# Altium schematic sheet PIRA BLE, LORA, RTC.SchDoc
size A3; SheetNumber: 3
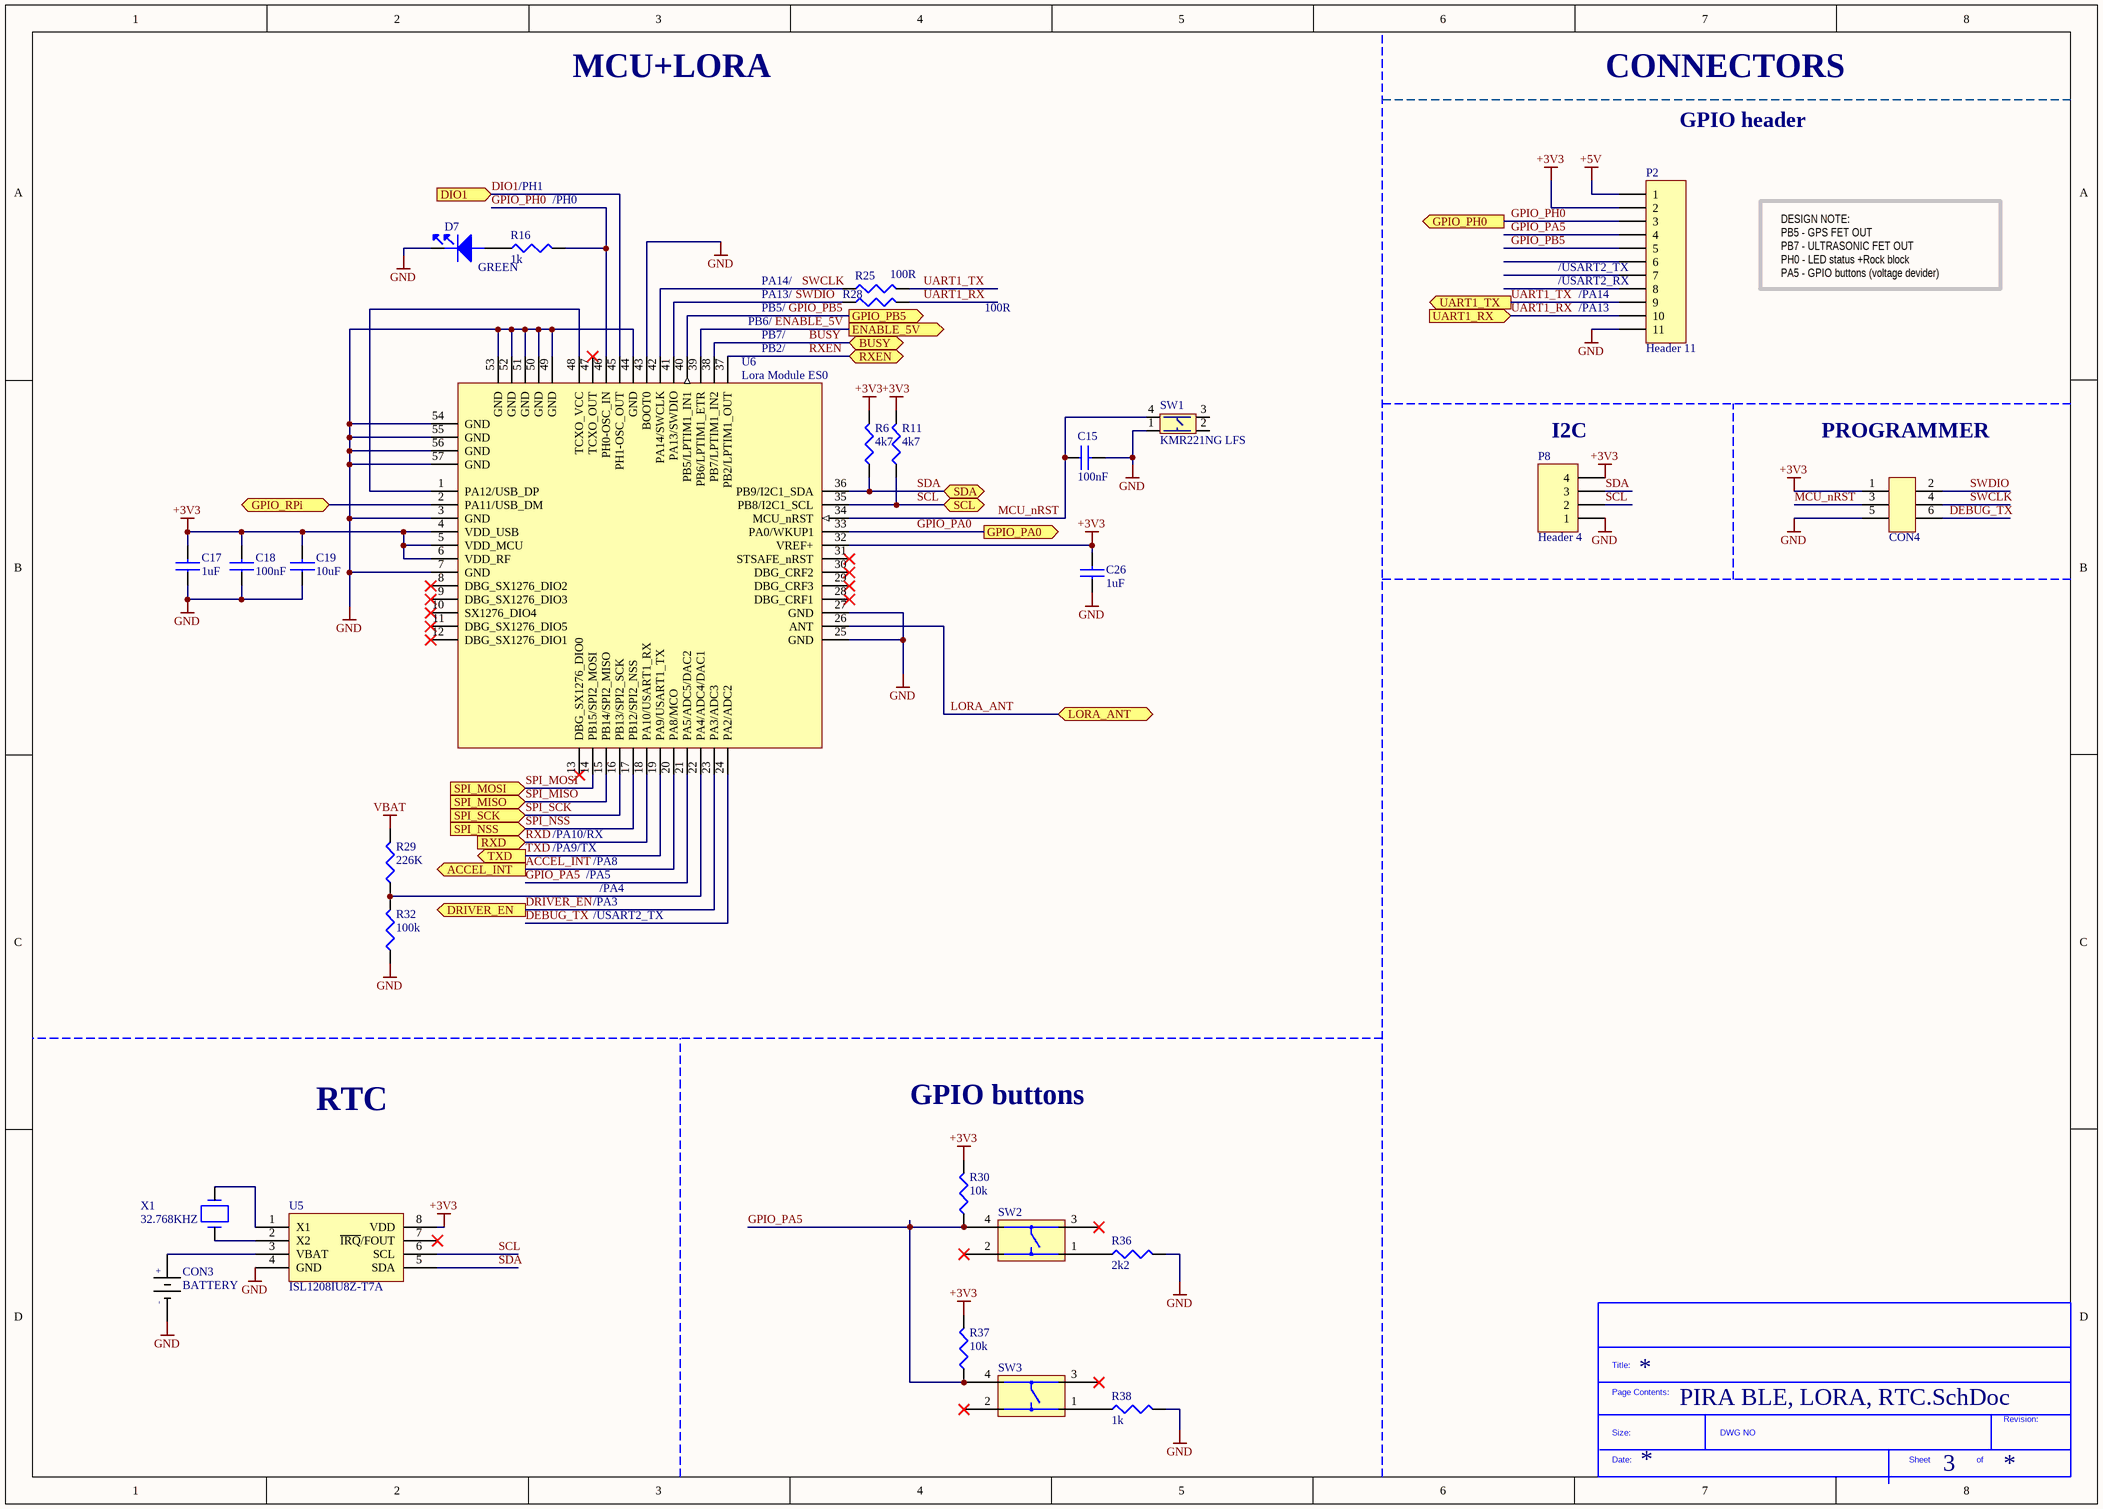
[diagram p0: PIRA BLE, LORA, RTC.SchDoc]

## Parts
*?  SDTitleBlock  (value not drawn)  (graphical)
C15  100nF  [CAP0603]
C17  1uF  [CAP0603]
C18  100nF  [CAP0603]
C19  10uF  [CAP0603]
C26  1uF  [CAP0603]
CON3  BATTERY  [CR-2032/VCN]
CON4  Tag connect  [TC2030-IDC-NL]  (value not drawn)  (no BOM)
D7  LED GREEN  [LED0603]  (value not drawn)
P2  Header 11  [HDR1X11]
P8  Header 4  [HDR1X4]
R6  4k7  [RES0603]
R11  4k7  [RES0603]
R16  1k  [RES0603]
R25  100R  [RES0603]
R28  100R  [RES0603]
R29  226K  [RES0603]
R30  10k  [RES0603]
R32  100k  [RES0603]
R36  2k2  [RES0603]
R37  10k  [RES0603]
R38  1k  [RES0603]
SW1  KMR221NG LFS  [Tactile button]
SW2  BTN - B3F-1070  [BTN B3F-1070]  (value not drawn)
SW3  BTN - B3F-1070  [BTN B3F-1070]  (value not drawn)
U5  ISL1208IU8Z-T7A  [TSOP65P500X110-8N]
U6  Lora Module ES0  [Lora Module ES0]
X1  32.768KHZ  [LFXTAL009678]

## Ports
ACCEL_INT (out), BUSY (bidir), DIO1 (in), DRIVER_EN (out), ENABLE_5V (out), GPIO_PA0 (out), GPIO_PB5 (out), GPIO_PH0 (out), GPIO_RPi (bidir), LORA_ANT (bidir), RXD (in), RXEN (bidir), SCL (bidir), SDA (bidir), SPI_MISO (in), SPI_MOSI (in), SPI_NSS (in), SPI_SCK (in), TXD (out), UART1_RX (in), UART1_TX (out)

## Nets
+3V3: C17.2 C18.2 C19.2 C26.2 CON4.1 P2.2 P8.4 R6.2 R11.2 R30.2 R37.2 U5.8(VDD) U6.4(VDD_USB) U6.5(VDD_MCU) U6.6(VDD_RF) U6.32(VREF+)
+5V: P2.1
GND: C15.2 C17.1 C18.1 C19.1 C26.1 CON3.NEG CON4.5 D7.1(cathode) P2.11 P8.1 R32.1 R36.2 R38.2 SW1.1 U5.4(GND) U6.3(GND) U6.7(GND) U6.25(GND) U6.27(GND) U6.43(BOOT0) U6.44(GND) U6.49(GND) U6.50(GND) U6.51(GND) U6.52(GND) U6.53(GND) U6.54(GND) U6.55(GND) U6.56(GND) U6.57(GND)
VBAT: R29.2
ACCEL_INT: U6.20(PA8/MCO) ; port ACCEL_INT
BUSY: U6.38(PB7/LPTIM1_IN2) ; port BUSY
DEBUG_TX: CON4.6 U6.24(PA2/ADC2)
DIO1: U6.45(PH1-OSC_OUT) ; port DIO1
DRIVER_EN: U6.23(PA3/ADC3) ; port DRIVER_EN
ENABLE_5V: U6.39(PB6/LPTIM1_ETR) ; port ENABLE_5V
GPIO_PA0: U6.33(PA0/WKUP1) ; port GPIO_PA0
GPIO_PA5: P2.4 R30.1 R37.1 SW2.4 SW3.4 U6.21(PA5/ADC5/DAC2)
GPIO_PB5: P2.5 U6.40(PB5/LPTIM1_IN1) ; port GPIO_PB5
GPIO_PH0: P2.3 R16.2 U6.46(PH0-OSC_IN) ; port GPIO_PH0
GPIO_RPi: U6.2(PA11/USB_DM) ; port GPIO_RPi
LORA_ANT: U6.26(ANT) ; port LORA_ANT
MCU_nRST: C15.1 CON4.3 SW1.4 U6.34(MCU_nRST)
RXD: U6.18(PA10/USART1_RX) ; port RXD
RXEN: U6.37(PB2/LPTIM1_OUT) ; port RXEN
SCL: P8.2 R11.1 U5.6(SCL) U6.35(PB8/I2C1_SCL) ; port SCL
SDA: P8.3 R6.1 U5.5(SDA) U6.36(PB9/I2C1_SDA) ; port SDA
SPI_MISO: U6.15(PB14/SPI2_MISO) ; port SPI_MISO
SPI_MOSI: U6.14(PB15/SPI2_MOSI) ; port SPI_MOSI
SPI_NSS: U6.17(PB12/SPI2_NSS) ; port SPI_NSS
SPI_SCK: U6.16(PB13/SPI2_SCK) ; port SPI_SCK
SWCLK: CON4.4 R25.1 U6.42(PA14/SWCLK)
SWDIO: CON4.2 R28.1 U6.41(PA13/SWDIO)
TXD: U6.19(PA9/USART1_TX) ; port TXD
UART1_RX: P2.10 R28.2 ; port UART1_RX
UART1_TX: P2.9 R25.2 ; port UART1_TX
NetCON3_POS: CON3.POS U5.3(VBAT)
NetD7_2: D7.2(ANODE) R16.1
NetR29_1: R29.1 R32.2 U6.22(PA4/ADC4/DAC1)
NetR36_1: R36.1 SW2.1
NetR38_1: R38.1 SW3.1
NetU5_1: U5.1(X1) X1.2
NetU5_2: U5.2(X2) X1.1
NetU6_1: U6.1(PA12/USB_DP) U6.48(TCXO_VCC)

Not connected (* = marked no-connect by the designer): P2 6 7 8; SW1 2 3; SW2 2* 3*; SW3 2* 3*; U5 7(~{IRQ}/FOUT)*; U6 8(DBG_SX1276_DIO2)* 9(DBG_SX1276_DIO3)* 10(SX1276_DIO4)* 11(DBG_SX1276_DIO5)* 12(DBG_SX1276_DIO1)* 13(DBG_SX1276_DIO0)* 28(DBG_CRF1)* 29(DBG_CRF3)* 30(DBG_CRF2)* 31(STSAFE_nRST)* 47(TCXO_OUT)*

## Notes on the sheet
- MCU+LORA
- CONNECTORS
- GPIO header
- /PH1
- (near R16) /PH0
- PB5/
- PA13/
- PA14/
- (near P2) /USART2_TX
- (near P2) /USART2_RX
- (near P2) /PA13
- (near P2) /PA14
- DESIGN NOTE:
  PB5 - GPS FET OUT
  PB7 - ULTRASONIC FET OUT
  PH0 - LED status +Rock block
  PA5 - GPIO buttons (voltage devider)
- PB6/
- (near U6) PB7/
- (near U6) PB2/
- (near P8) I2C
- (near CON4) PROGRAMMER
- /PA9/TX
- /PA10/RX
- /PA5
- /PA8
- /PA3
- /USART2_TX
- /PA4
- RTC
- GPIO buttons
- (in symbol CR-2032/VCN) +; -
- (in symbol LED - LED GREEN) GREEN
- (in symbol SDTitleBlock) Title:; Page Contents:; Revision:; Size:; DWG NO; Date:; Sheet; of

## Library data of the parts
C15 C18 = 100nF: MURATA - GRM188R71C104KA01J - CAP, MLCC, X7R, 0.1UF, 16V, 0603; Ceramic Capacitor Case: 0603 [1608 Metric]; Capacitance: 0.1; Voltage Rating: 16; Capacitance Tolerance: ± 10%; Dielectric Characteristic: X7; Product Range: GRM Series; SVHC: No SVHC (20-Jun-2016; Supplier 1: Farnell; Manufacturer: MURATA; Manufacturer Part Number: GRM188R71C104KA01J; RoHS: YES; Stock 1: 18297; Pricing 1: 10=0.0145, 100=0.0126, 500=0.0081, 2500=0.0059, 5000=0.0052, 10000=0.0046, 50000=0.0036, 100000=0.0035 (GBP); Packaging: Cut Tape; Operating Temperature Min: -55; Operating Temperature Max: 125; Automotive Qualification Standard: -; MSL: MSL 1 - Unlimited; ComponentLink1URL: http://www.farnell.com/datasheets/2189124.pdf; ComponentLink1Description: http://www.farnell.com/datasheets/2189124.pdf; Supplier Part Number 1: 2688519
C17 = 1uF: MURATA - GRM188R61H105KAALD - CAP, MLCC, X5R, 1UF, 50V, 0603; Ceramic Capacitor Case: 0603 [1608 Metric]; Capacitance: 1; Voltage Rating: 50; Capacitance Tolerance: ± 10%; Dielectric Characteristic: X5; Product Range: GRM Series; SVHC: No SVHC (17-Dec-2015); Capacitor Terminals: SMD<!--FANDB--><div class="features-and-benefits-container"><div class="features-and-benefits-description"><span class="features-benefits-value">The Murata GRM series capacitors are Multilayer Ceramic Chip Capacitors (MLCC) used for general purpose applications. These MLCC capacitors are classified into temperature compensating and high dielectric constant types depending on the change in electrostatic capacitance due to change in temperature. The temperature compensating capacitors feature a small rate of change in electrostatic capacitance as the temperature changes and are used for applications such as filters and high frequency circuit matching. The high dielectric constant capacitors use materials with a high dielectric constant and feature a large electrostatic capacitance. Typical applications are power supply decoupling and smoothing circuits.</span></div><div class="features-and-benefits-list"><ul class="features-and-benefits-list-list"><li class="features-and-benefits-list-item">Large capacity and small size in a multilayer structure</li><li class="features-and-benefits-list-item">Capacitance value ranging from 0.1pF to 220?F</li><li class="features-and-benefits-list-item">Tin plated external electrodes, excellent solderability</li><li class="features-and-benefits-list-item">Provides good high frequency characteristics</li><li class="features-and-benefits-list-item">Excellent pulse response</li><li class="features-and-benefits-list-item">High reliability</li><li class="features-and-benefits-list-item">Capacitor size varies from 0.4×0.2mm to 5.7×5.0mm</li><li class="features-and-benefits-list-item">Rated voltage of 2.5VDC to 3.15; Supplier 1: Farnell; Manufacturer: MURATA; Manufacturer Part Number: GRM188R61H105KAALD; RoHS: YES; Stock 1: 62682; Pricing 1: 10=0.093, 100=0.062, 500=0.0507, 1000=0.0465, 2000=0.0429, 4000=0.0399, 20000=0.0372, 40000=0.0365 (GBP); Packaging: Cut Tape; Operating Temperature Min: -55; Operating Temperature Max: 85; Automotive Qualification Standard: -; MSL: -; Capacitance Tolerance ±: ± 10%; ComponentLink1URL: http://www.farnell.com/datasheets/2048611.pdf; ComponentLink1Description: http://www.farnell.com/datasheets/2048611.pdf; Supplier Part Number 1: 1845736
C19 = 10uF: 10uf/0603/20%; Manufacturer: KEMET; Manufacturer Part Number: C0603C106M8PACTU; Supplier 1: Farnell; Stock 1: 0; Pricing 1: 10=0.555, 100=0.315, 500=0.238, 1000=0.2, 2000=0.174, 4000=0.143, 20000=0.123 (GBP); Supplier Part Number 1: 2820985
C26 = C - 1uF: MURATA - GRM188R61H105KAALD - CAP, MLCC, X5R, 1UF, 50V, 0603; IRNAS Part No.: I-200006; Ceramic Capacitor Case: 0603 [1608 Metric]; Capacitance: 1; Voltage Rating: 50; Capacitance Tolerance: ± 10%; Dielectric Characteristic: X5; Product Range: GRM Series; SVHC: No SVHC (17-Dec-2015); Capacitor Terminals: SMD<!--FANDB--><div class="features-and-benefits-container"><div class="features-and-benefits-description"><span class="features-benefits-value">The Murata GRM series capacitors are Multilayer Ceramic Chip Capacitors (MLCC) used for general purpose applications. These MLCC capacitors are classified into temperature compensating and high dielectric constant types depending on the change in electrostatic capacitance due to change in temperature. The temperature compensating capacitors feature a small rate of change in electrostatic capacitance as the temperature changes and are used for applications such as filters and high frequency circuit matching. The high dielectric constant capacitors use materials with a high dielectric constant and feature a large electrostatic capacitance. Typical applications are power supply decoupling and smoothing circuits.</span></div><div class="features-and-benefits-list"><ul class="features-and-benefits-list-list"><li class="features-and-benefits-list-item">Large capacity and small size in a multilayer structure</li><li class="features-and-benefits-list-item">Capacitance value ranging from 0.1pF to 220?F</li><li class="features-and-benefits-list-item">Tin plated external electrodes, excellent solderability</li><li class="features-and-benefits-list-item">Provides good high frequency characteristics</li><li class="features-and-benefits-list-item">Excellent pulse response</li><li class="features-and-benefits-list-item">High reliability</li><li class="features-and-benefits-list-item">Capacitor size varies from 0.4×0.2mm to 5.7×5.0mm</li><li class="features-and-benefits-list-item">Rated voltage of 2.5VDC to 3.15; Supplier 1: Farnell; Manufacturer: MURATA; Manufacturer Part Number: GRM188R61H105KAALD; RoHS: YES; Stock 1: 62682; Pricing 1: 10=0.093, 100=0.062, 500=0.0507, 1000=0.0465, 2000=0.0429, 4000=0.0399, 20000=0.0372, 40000=0.0365 (GBP); Packaging: Cut Tape; Operating Temperature Min: -55; Operating Temperature Max: 85; Automotive Qualification Standard: -; MSL: -; Capacitance Tolerance ±: ± 10%; ComponentLink1URL: http://www.farnell.com/datasheets/2048611.pdf; ComponentLink1Description: http://www.farnell.com/datasheets/2048611.pdf; Supplier Part Number 1: 1845736
CON3 = CR-2032/VCN: BATT LITH COIN 3V CELL PC PINS; Manufacturer: Panasonic BSG; Brand: Panasonic Battery; Battery Size: 2032; Capacity: 225 mAh; Chemistry: Lithium; Rechargeable/Non-Rechargeable: Non-Rechargeable; Supplier 1: Farnell; Manufacturer Part Number: CR-2032/VCN; Stock 1: 1004; Pricing 1: 1=0.91, 50=0.892, 100=0.874, 500=0.855, 1000=0.837 (GBP); Product Category: Coin Cell Battery; RoHS: Not Applicable; Series: CR; Output Voltage: 3 V; Termination Style: Through Hole; Orientation: Vertical; Diameter: 20 mm; Height: 3.2 mm; Operating Temperature Range: - 30 C to + 60 C; Packaging: Bulk; Factory Pack Quantity: 480; Type: Lithium Primary Coil Batteries; Part # Aliases: CR-2032/VCN; ComponentLink1URL: http://www.mouser.com/ds/2/315/AAA4000CE51-586417.pdf; ComponentLink1Description: http://www.mouser.com/ds/2/315/AAA4000CE51-586417.pdf; ComponentLink2URL: http://uk.rs-online.com/webdocs/108e/0900766b8108ebf4.pdf; ComponentLink2Description: http://uk.rs-online.com/webdocs/108e/0900766b8108ebf4.pdf; ComponentLink3URL: https://na.industrial.panasonic.com/sites/default/pidsa/files/panasonic-lithium-cr2032-datasheet.pdf; ComponentLink3Description: https://na.industrial.panasonic.com/sites/default/pidsa/files/panasonic-lithium-cr2032-datasheet.pdf; Supplier Part Number 1: 1892670
CON4 = tag connecot 6 pin
D7 = LED - LED GREEN: HSME-C191 -  LED, Green, SMD, 0603, 20 mA, 2.1 V, 572 nm; Manufacturer: BROADCOM LIMITED; Manufacturer Part Number: HSMS-C190; LED Colour: Red; Forward Current If: 20; Forward Voltage: 2.1; Wavelength Typ: 626; Luminous Intensity: 10; Viewing Angle: 170°; Lens Shape: Rectangular; SVHC: No SVHC (17-Dec-2015)<!--FANDB--><div class="features-and-benefits-container"><div class="features-and-benefits-description"><span class="features-benefits-value">The HSMS-C190 is a HER SMD Chip LED with untinted/diffused lens, made of GaP. It is designed in an industry standard package 1.6 x 0.8mm footprint with 0.8mm profile. It is compatible with IR reflow solder processes. The small size and wide viewing angle make this LED prime choices for backlighting applications and front panel illumination especially where space is a premium.</span></div><div class="features-and-benefits-list"><ul class="features-and-benefits-list-list"><li class="features-and-benefits-list-item">Small size</li><li class="features-and-benefits-list-item">Industry standard footprint</li><li class="features-and-benefits-list-item">Compatible with IR solder</li><li class="features-and-benefits-list-item">Diffused optics</li><li class="features-and-benefits-list-item">-40 to 85; RoHS: YES; Stock 1: 7534; Pricing 1: 1=0.361, 10=0.256, 50=0.235, 100=0.106, 200=0.101 (GBP); LED Mounting: SMD; Bulb Size: -; Packaging: Cut Tape; Product Range: -; Automotive Qualification Standard: -; MSL: -; ComponentLink3URL: http://www.farnell.com/datasheets/2095939.pdf?_ga=2.85835929.1644194861.1561957338-1373726713.1554121096; ComponentLink3Description: Datasheet; Supplier 1: Farnell; Supplier Part Number 1: 1219743
P2 = Header 11: Header, 11-Pin; LatestRevisionDate: 17-Jul-2002; LatestRevisionNote: Re-released for DXP Platform.; Publisher: Altium Limited; Supplier Part Number 1: Header 2.54mm
P8 = Header 4: Header, 4-Pin; LatestRevisionDate: 17-Jul-2002; LatestRevisionNote: Re-released for DXP Platform.; Publisher: Altium Limited; Supplier Part Number 1: Header 2.54mm
R6 R11 = R - 4k7: MULTICOMP - MCMR06X4701FTL - RES, CERAMIC, 4K7, 1%, 0.1W, 0603; IRNAS Part No.: I-100003; Resistance: 4.7; Voltage Rating: 75; Resistor Case Style: 0603 [1608 Metric]; Power Rating: 100; Product Range: MCMR Series; Temperature Coefficient: ± 100; SVHC: No SVHC (12-Jan-2017)<!--FANDB--><div class="features-and-benefits-container"><div class="features-and-benefits-description"><span class="features-benefits-value">The Multicomp MCMR series resistors are automotive grade, anti sulphured thick film chip resistor. The resistance range includes E24 and E96 decade values from 1ohm to 10Mohm. These resistors are constructed on top of a high grade ceramic body.</span></div><div class="features-and-benefits-list"><ul class="features-and-benefits-list-list"><li class="features-and-benefits-list-item">EIA 0402, 0603, 0805, 1206 chip sizes available</li><li class="features-and-benefits-list-item">High reliability and stability</li><li class="features-and-benefits-list-item">Automotive grade AEC-Q200 compliant</li><li class="features-and-benefits-list-item">Complaint with (IEC 60068-1) 55/155/56 climatic category</li><li class="features-and-benefits-list-item">Maximum operation voltage of 50V, 75V, 150V and 200V</li><li class="features-and-benefits-list-item">Power rating of 62.5mW, 100mW, 125mW and 250mW</li><li class="features-and-benefits-list-item">Available in ±1% and ±5% tolerance</li><li class="features-and-benefits-list-item">Temperature coefficient (TCR) of +200ppm/°C, +100ppm/°C and -200ppm/°C to +400ppm/°C</li><li class="features-and-benefits-list-item">Operating temperature range -55°C to 155; Supplier 1: Farnell; Manufacturer: MULTICOMP; Manufacturer Part Number: MCMR06X4701FTL; RoHS: Y-EX; Stock 1: 218618; Pricing 1: 10=0.0085, 100=0.0051, 500=0.0036, 1000=0.0028, 2500=0.0023 (GBP); Resistance Tolerance: ± 1%; Packaging: Cut Tape; Resistor Element Material: Ceramic; Automotive Qualification Standard: -; ComponentLink1URL: http://www.farnell.com/datasheets/1716707.pdf; ComponentLink1Description: http://www.farnell.com/datasheets/1716707.pdf; Supplier Part Number 1: 2073509
R16 R38 = R - 1k: MULTICOMP - MCMR06X102 JTL - RES, CERAMIC, 1K, 5%, 0.1W, 0603; IRNAS Part No.: I-100042; Resistance: 1; Voltage Rating: 75; Resistor Case Style: 0603 [1608 Metric]; Power Rating: 100; Product Range: MCMR Series; Temperature Coefficient: ± 100; Resistor Mounting: Surface Mount Device<!--FANDB--><div class="features-and-benefits-container"><div class="features-and-benefits-description"><span class="features-benefits-value">The Multicomp MCMR series resistors are automotive grade, anti sulphured thick film chip resistor. The resistance range includes E24 and E96 decade values from 1ohm to 10Mohm. These resistors are constructed on top of a high grade ceramic body.</span></div><div class="features-and-benefits-list"><ul class="features-and-benefits-list-list"><li class="features-and-benefits-list-item">EIA 0402, 0603, 0805, 1206 chip sizes available</li><li class="features-and-benefits-list-item">High reliability and stability</li><li class="features-and-benefits-list-item">Automotive grade AEC-Q200 compliant</li><li class="features-and-benefits-list-item">Complaint with (IEC 60068-1) 55/155/56 climatic category</li><li class="features-and-benefits-list-item">Maximum operation voltage of 50V, 75V, 150V and 200V</li><li class="features-and-benefits-list-item">Power rating of 62.5mW, 100mW, 125mW and 250mW</li><li class="features-and-benefits-list-item">Available in ±1% and ±5% tolerance</li><li class="features-and-benefits-list-item">Temperature coefficient (TCR) of +200ppm/°C, +100ppm/°C and -200ppm/°C to +400ppm/°C</li><li class="features-and-benefits-list-item">Operating temperature range -55°C to 155; Supplier 1: Farnell; Manufacturer: MULTICOMP; Manufacturer Part Number: MCMR06X102 JTL; RoHS: Y-EX; Stock 1: 18133; Pricing 1: 10=0.0089, 100=0.0076, 500=0.0063, 1000=0.0049, 2500=0.0033, 5000=0.0024, 25000=0.0016, 50000=0.0013 (GBP); Resistance Tolerance: ± 5%; Packaging: Cut Tape; Resistor Element Material: Ceramic; Automotive Qualification Standard: -; ComponentLink1URL: http://www.farnell.com/datasheets/1716707.pdf; ComponentLink1Description: http://www.farnell.com/datasheets/1716707.pdf; Supplier Part Number 1: 2073354
R25 R28 = R - 100R: MULTICOMP - MC0063W06031100R - RES, THICK FILM, 100R, 1%, 0.063W, 0603; IRNAS Part No.: I-100009; Resistance: 100; Voltage Rating: 50; Resistor Case Style: 0603 [1608 Metric]; Power Rating: 63; Product Range: MC Series; Temperature Coefficient: ± 200; SVHC: No SVHC (12-Jan-2017); External Depth: 0.45; External Length / Height: 1.6; External Width: 0.8; No. of Pins: 2; Reel Quantity: 5000; Resistor Mounting: Surface Mount Device; Temperature Coeff. +: 200; Voltage Rating V DC: 50V<!--FANDB--><div class="features-and-benefits-container"><div class="features-and-benefits-description"><span class="features-benefits-value">The Multicomp MC series current sense resistors are thick film chip resistors. The resistance range includes E96 and E24 decade values from 1ohm to 10Mohm.</span></div><div class="features-and-benefits-list"><ul class="features-and-benefits-list-list"><li class="features-and-benefits-list-item">EIA 0402, 0603, 0805, 1206 chip sizes available</li><li class="features-and-benefits-list-item">Small size and low weight</li><li class="features-and-benefits-list-item">Suitable for both wave and reflow soldering</li><li class="features-and-benefits-list-item">Reduction of assembly costs</li><li class="features-and-benefits-list-item">Maximum working voltage of 50V(0402, 0603), 150V(0805), 200V(1206)</li><li class="features-and-benefits-list-item">Available in ±1%, ±2% and ±5% tolerance</li><li class="features-and-benefits-list-item">Power rating of 62.5mW, 100mW and 125mW</li><li class="features-and-benefits-list-item">±400ppm/°C(1ohm to 10ohm), ±200ppm/°C(11ohm to 100ohm), ±100; Supplier 1: Farnell; Manufacturer: MULTICOMP; Manufacturer Part Number: MC0063W06031100R; RoHS: Y-EX; Stock 1: 78152; Pricing 1: 10=0.0011, 100=0.001, 500=0.0009, 1000=0.0008, 2500=0.0007 (GBP); Resistance Tolerance: ± 1%; Packaging: Cut Tape; Resistor Element Material: Thick Film; Automotive Qualification Standard: -; Operating Temperature Max: 155; Operating Temperature Min: -55; Operating Temperature Range: -55°C to +155; Tape Width: 8; Temperature Coeff. -: 200; Tolerance +: 1%; Tolerance -: 1%; ComponentLink1URL: http://www.farnell.com/datasheets/1788326.pdf; ComponentLink1Description: http://www.farnell.com/datasheets/1788326.pdf; ComponentLink2URL: http://www.farnell.com/cad/1561149.zip; ComponentLink2Description: http://www.farnell.com/cad/1561149.zip; ComponentLink3URL: http://www.farnell.com/datasheets/2289252.pdf; ComponentLink3Description: http://www.farnell.com/datasheets/2289252.pdf; Supplier Part Number 1: 9330364
R29 = 226K: Thick Film Resistors - SMD 1/10watt 226Kohms 1%; Manufacturer: Vishay; Manufacturer Part Number: CRCW0603226KFKEA; Brand: Vishay / Dale; Power Rating: 100 mW; Temperature Coefficient: 100 PPM / K; Voltage Rating: 75 V; Unit Weight: 0.000071 oz; Supplier 1: Farnell; Stock 1: 6700; Pricing 1: 10=0.0188, 100=0.0145, 500=0.0124, 1000=0.008 (GBP); Product Category: Thick Film Resistors - SMD; RoHS: Details; Resistance: 226 kOhms; Tolerance: 1 %; Case Code - in: 0603; Case Code - mm: 1608; Operating Temperature Range: - 55 C to + 155 C; Series: CRCW; Height: 0.45 mm; Length: 1.55 mm; Package / Case: 0603 (1608 metric); Packaging: Reel; Product: Thick Film Resistors SMD; Factory Pack Quantity: 5000; Termination Style: SMD/SMT; Width: 0.85 mm; ComponentLink1URL: http://www.mouser.com/ds/2/427/dcrcwe3-109170.pdf; ComponentLink1Description: http://www.mouser.com/ds/2/427/dcrcwe3-109170.pdf; ComponentLink2URL: http://www.vishay.com/docs/20035/dcrcwe3.pdf; ComponentLink2Description: http://www.vishay.com/docs/20035/dcrcwe3.pdf; ComponentLink3URL: http://www.farnell.com/datasheets/2045674.pdf; ComponentLink3Description: http://www.farnell.com/datasheets/2045674.pdf; ComponentLink4URL: https://www.alliedelec.com/m/d/0c934d6939ccefa68dbe0b96d821c8cf.pdf; ComponentLink4Description: https://www.alliedelec.com/m/d/0c934d6939ccefa68dbe0b96d821c8cf.pdf; ComponentLink5URL: http://uk.rs-online.com/webdocs/0d98/0900766b80d98afc.pdf; ComponentLink5Description: http://uk.rs-online.com/webdocs/0d98/0900766b80d98afc.pdf; ComponentLink6URL: http://www.alliedelec.com/m/d/0c934d6939ccefa68dbe0b96d821c8cf.pdf; ComponentLink6Description: http://www.alliedelec.com/m/d/0c934d6939ccefa68dbe0b96d821c8cf.pdf; ComponentLink7URL: http://www.farnell.com/datasheets/2111203.pdf; ComponentLink7Description: http://www.farnell.com/datasheets/2111203.pdf; Supplier Part Number 1: 2138531
R30 R37 = R - 10k: MULTICOMP - MCMR06X103 JTL - RES, CERAMIC, 10K, 5%, 0.1W, 0603; IRNAS Part No.: I-100008; Resistance: 10; Voltage Rating: 75; Resistor Case Style: 0603 [1608 Metric]; Power Rating: 100; Product Range: MCMR Series; Temperature Coefficient: ± 100; Automotive Qualification Standard: -<!--FANDB--><div class="features-and-benefits-container"><div class="features-and-benefits-description"><span class="features-benefits-value">The Multicomp MCMR series resistors are automotive grade, anti sulphured thick film chip resistor. The resistance range includes E24 and E96 decade values from 1ohm to 10Mohm. These resistors are constructed on top of a high grade ceramic body.</span></div><div class="features-and-benefits-list"><ul class="features-and-benefits-list-list"><li class="features-and-benefits-list-item">EIA 0402, 0603, 0805, 1206 chip sizes available</li><li class="features-and-benefits-list-item">High reliability and stability</li><li class="features-and-benefits-list-item">Automotive grade AEC-Q200 compliant</li><li class="features-and-benefits-list-item">Complaint with (IEC 60068-1) 55/155/56 climatic category</li><li class="features-and-benefits-list-item">Maximum operation voltage of 50V, 75V, 150V and 200V</li><li class="features-and-benefits-list-item">Power rating of 62.5mW, 100mW, 125mW and 250mW</li><li class="features-and-benefits-list-item">Available in ±1% and ±5% tolerance</li><li class="features-and-benefits-list-item">Temperature coefficient (TCR) of +200ppm/°C, +100ppm/°C and -200ppm/°C to +400ppm/°C</li><li class="features-and-benefits-list-item">Operating temperature range -55°C to 155; Supplier 1: Farnell; Manufacturer: MULTICOMP; Manufacturer Part Number: MCMR06X103 JTL; RoHS: Y-EX; Stock 1: 19791; Pricing 1: 10=0.0087, 100=0.0074, 500=0.0061, 1000=0.0048, 2500=0.0032, 5000=0.0024, 25000=0.0016, 50000=0.0013 (GBP); Resistance Tolerance: ± 5%; Packaging: Cut Tape; Resistor Element Material: Ceramic; ComponentLink1URL: http://www.farnell.com/datasheets/1716707.pdf; ComponentLink1Description: http://www.farnell.com/datasheets/1716707.pdf; Supplier Part Number 1: 2073356
R32 = 100k: MULTICOMP - MCMR06X104 JTL - RES, CERAMIC, 100K, 5%, 0.1W, 0603; Resistance: 100; Voltage Rating: 75; Resistor Case Style: 0603 [1608 Metric]; Product Range: MCMR Series; Temperature Coefficient: ± 100; Resistor Mounting: Surface Mount Device<!--FANDB--><div class="features-and-benefits-container"><div class="features-and-benefits-description"><span class="features-benefits-value">The Multicomp MCMR series resistors are automotive grade, anti sulphured thick film chip resistor. The resistance range includes E24 and E96 decade values from 1ohm to 10Mohm. These resistors are constructed on top of a high grade ceramic body.</span></div><div class="features-and-benefits-list"><ul class="features-and-benefits-list-list"><li class="features-and-benefits-list-item">EIA 0402, 0603, 0805, 1206 chip sizes available</li><li class="features-and-benefits-list-item">High reliability and stability</li><li class="features-and-benefits-list-item">Automotive grade AEC-Q200 compliant</li><li class="features-and-benefits-list-item">Complaint with (IEC 60068-1) 55/155/56 climatic category</li><li class="features-and-benefits-list-item">Maximum operation voltage of 50V, 75V, 150V and 200V</li><li class="features-and-benefits-list-item">Power rating of 62.5mW, 100mW, 125mW and 250mW</li><li class="features-and-benefits-list-item">Available in ±1% and ±5% tolerance</li><li class="features-and-benefits-list-item">Temperature coefficient (TCR) of +200ppm/°C, +100ppm/°C and -200ppm/°C to +400ppm/°C</li><li class="features-and-benefits-list-item">Operating temperature range -55°C to 155; Supplier 1: Farnell; Manufacturer: MULTICOMP; Manufacturer Part Number: MCMR06X104 JTL; RoHS: Y-EX; Stock 1: 187; Pricing 1: 10=0.0109, 100=0.0085, 500=0.006, 1000=0.0048, 2500=0.004, 5000=0.003, 25000=0.002, 50000=0.0016 (GBP); Power Rating: 100; Resistance Tolerance: ± 5%; Packaging: Cut Tape; Resistor Element Material: Ceramic; Automotive Qualification Standard: -; ComponentLink1URL: http://www.farnell.com/datasheets/1716707.pdf; ComponentLink1Description: http://www.farnell.com/datasheets/1716707.pdf; Supplier Part Number 1: 2073357
R36 = R - 2k2: MULTICOMP - MCMR06X2201FTL - RES, CERAMIC, 2K2, 1%, 0.1W, 0603; IRNAS Part No.: I-100024; Supplier 1: Farnell; Manufacturer: MULTICOMP; Manufacturer Part Number: MCMR06X2201FTL; RoHS: Y-EX; Stock 1: 17638; Pricing 1: 10=0.0099, 100=0.0059, 500=0.0042, 1000=0.0033, 2500=0.0027 (GBP); ComponentLink1URL: http://www.farnell.com/datasheets/1716707.pdf; ComponentLink1Description: http://www.farnell.com/datasheets/1716707.pdf; Supplier Part Number 1: 2073429
SW1 = Tactile button: SWITCH TACTILE SPST-NO 0.05A 32V; Manufacturer: ITT C&K; Pole Throw Configuration: SPST; Mechanical Life: 200000 Cycles; Switch Configuration: N.O.; Illumination Type: N/R; Ground Terminal: No; Body Orientation: Straight; Actuator Length: 0.5 mm; Operating Force: 2 N; Actuator Style: Round Button; Dielectric Strength: >=250 Vrms; Minimum Insulation Resistance: >=1000 MOhm; Contact Rating @ Voltage: 1 A; Supplier 1: C&K Components; Manufacturer Part Number: KMR221NGLFS; Stock 1: 4985; Pricing 1: 10=0.278, 500=0.264, 1000=0.208, 5000=0.204, 10000=0.2 (GBP); Part No: KMR221NGLFS; RoHS: Yes; Supplier Standard Pack: 7,000; Type: Micro-Miniature; Maximum AC Voltage Rating: N/A; Family: KMR 2; Contact Material: Silver; Actuator Color: N/A; Maximum DC Voltage Rating: 32 V; Seal Description: N/A; Packaging: Tape and Reel; Contact Plating: Silver; Electrical Life: N/A; Housing Material: N/A; Product Weight: N/A; Base Material: N/A; Mounting: Surface Mount,Gull Wing; Seal Location: N/A; Operating Temperature: -40 to 85 C; Dimension: 2.8 x 4.6 x 1.9 mm; HTS: 8536501199; ECCN: EAR99; ComponentLink1URL: https://www.ckswitches.com/media/1479/kmr2.pdf; ComponentLink1Description: https://www.ckswitches.com/media/1479/kmr2.pdf; ComponentLink2URL: http://www.ck-components.com/14414/kmr2_9aug12.pdf/; ComponentLink2Description: http://www.ck-components.com/14414/kmr2_9aug12.pdf/; ComponentLink3URL: http://www.ck-components.com/index.php?module=media&action=Display&cmpref=14414&lang=en&width=&height=&format=&alt=; ComponentLink3Description: http://www.ck-components.com/index.php?module=media&action=Display&cmpref=14414&lang=en&width=&height=&format=&alt=; ComponentLink4URL: http://www1.futureelectronics.com/doc/C%20-%20K%20COMPONENTS/KMR221NGLFS.pdf; ComponentLink4Description: http://www1.futureelectronics.com/doc/C%20-%20K%20COMPONENTS/KMR221NGLFS.pdf; Supplier Part Number 1: 2845727
SW2 SW3 = BTN - B3F-1070: Tactile Switch, B3F Series, Top Actuated, Through Hole, Round Button, 100 gf, 50mA at 24VDC; ComponentLink1Description: Datasheet; ComponentLink1URL: https://4donline.ihs.com/images/VipMasterIC/IC/OMRN/OMRN-S-A0001309768/OMRN-S-A0001309768-1.pdf?hkey=52A5661711E402568146F3353EA87419; Supplier 1: Farnell; Supplier Part Number 1: 959698
U5 = ISL1208IU8Z-T7A: IC RTC/CALENDAR I2C LP 8MSOP; Manufacturer: Intersil; Max Supply Voltage: 5.5V; Min Supply Voltage: 2.7V; Non-volatile Memory Size: 2B; Interface: I2C,Serial,2-Wire; Logic Function: Clock; Time Format: HH:MM:SS; Date Format: YY-MM-DD-dd; Supplier 1: Farnell; Manufacturer Part Number: ISL1208IU8Z-T7A; Stock 1: 321; Pricing 1: 1=2.63, 10=2.24, 25=2.12, 50=2.01, 100=1.89, 250=1.84, 500=1.65, 1000=1.37 (EUR); Mount: Surface Mount; Case/Package: MSOP; Number of Pins: 8; Min Operating Temperature: -40°C; Max Operating Temperature: 85°C; Packaging: Tape and Reel; Package Quantity: 250; Memory Size: 2B; Radiation Hardening: No; REACH SVHC: Unknown; Lead Free: Lead Free; ComponentLink1URL: https://datasheet.ciiva.com/16293/fn8085-16293145.pdf; ComponentLink1Description: https://datasheet.ciiva.com/16293/fn8085-16293145.pdf; ComponentLink2URL: https://datasheet.ciiva.com/8145/fn8085-8145071.pdf; ComponentLink2Description: https://datasheet.ciiva.com/8145/fn8085-8145071.pdf; ComponentLink3URL: https://datasheet.ciiva.com/6668/fn8085-6668119.pdf; ComponentLink3Description: https://datasheet.ciiva.com/6668/fn8085-6668119.pdf; ComponentLink4URL: https://datasheet.ciiva.com/6668/fn8085-6668117.pdf; ComponentLink4Description: https://datasheet.ciiva.com/6668/fn8085-6668117.pdf; ComponentLink5URL: https://datasheet.ciiva.com/6668/fn8085-6668118.pdf; ComponentLink5Description: https://datasheet.ciiva.com/6668/fn8085-6668118.pdf; Supplier Part Number 1: 2543322
U6 = Lora Module Murata: Manufacturer Part Number: CMWX1ZZABZ-091; Supplier 1: Farnell; Manufacturer: Murata; Stock 1: 175; Pricing 1: 1=11.7, 5=11.06, 10=9.94, 50=9.54, 100=9.14, 250=8.05 (GBP); Supplier Part Number 1: 2802546
X1 = LFXTAL009678: CRYSTAL, 32.768KHZ, 12.5PF, SMD; Manufacturer: IQD; Frequency: 32.8kHz; Supplier 1: Farnell; Manufacturer Part Number: LFXTAL009678; Stock 1: 15609; Pricing 1: 5=0.283, 50=0.203, 250=0.169, 500=0.163, 1500=0.157, 3000=0.152, 15000=0.146 (EUR); Case/Package: 217; Number of Pins: 2; Min Operating Temperature: -40°C; Max Operating Temperature: 85°C; Load Capacitance: 12.5pF; REACH SVHC: No SVHC; ComponentLink1URL: https://datasheet.ciiva.com/46419/1852967-46419749.pdf; ComponentLink1Description: https://datasheet.ciiva.com/46419/1852967-46419749.pdf; Supplier Part Number 1: 2449398